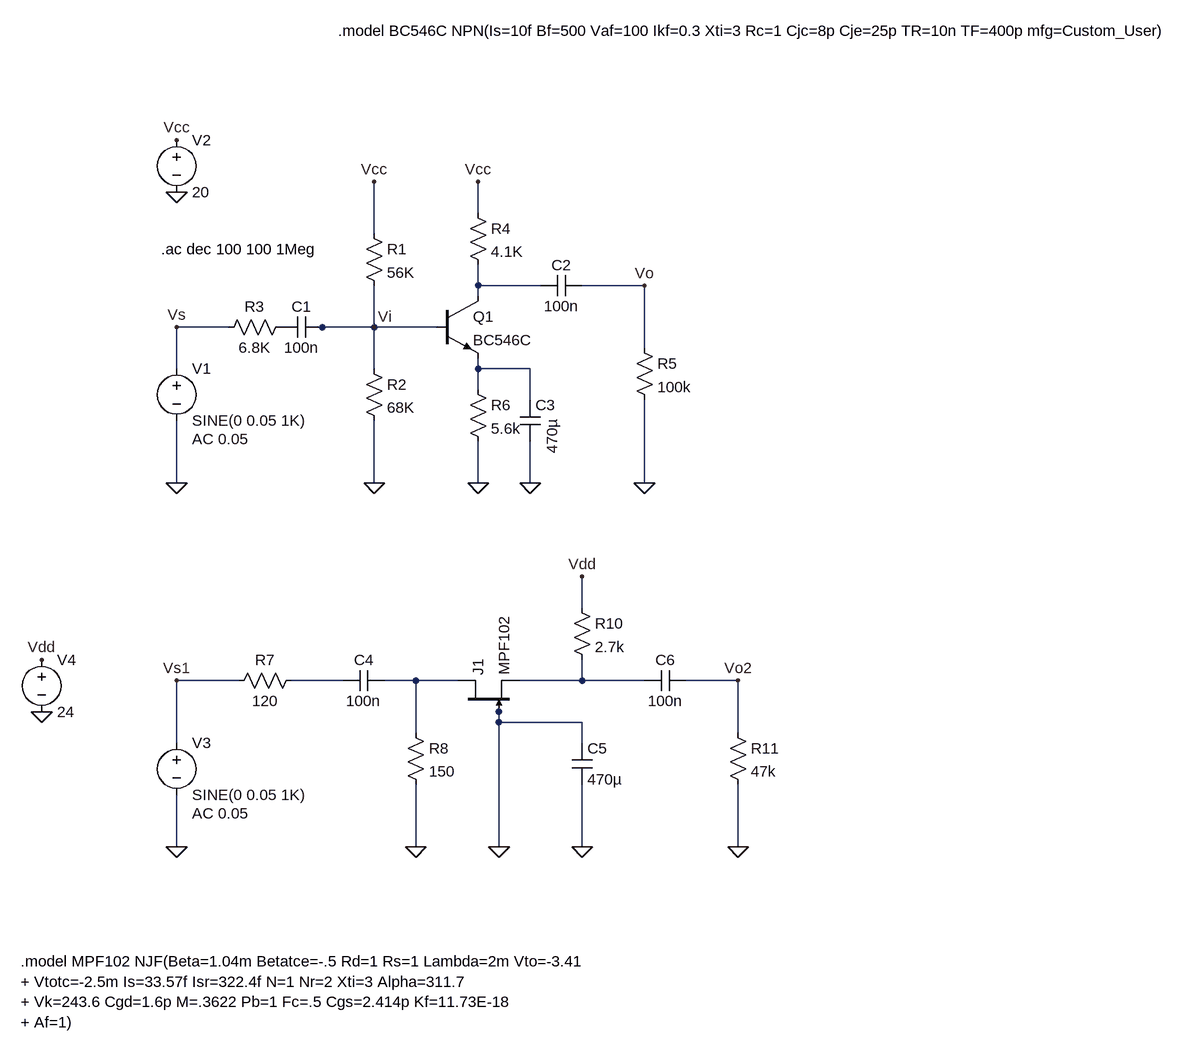
[diagram p0: schematic TP_EA1.asc]
TP_EA1.asc, the LTspice schematic file:
Version 4.1
SHEET 1 2792 1236
WIRE 224 -16 224 -64
WIRE 64 16 64 -64
WIRE 224 96 224 64
WIRE 320 96 224 96
WIRE 480 96 384 96
WIRE 224 112 224 96
WIRE -160 160 -240 160
WIRE -16 160 -32 160
WIRE 64 160 64 96
WIRE 64 160 -16 160
WIRE 160 160 64 160
WIRE 480 192 480 96
WIRE -240 224 -240 160
WIRE 64 224 64 160
WIRE 224 224 224 208
WIRE 304 224 224 224
WIRE 224 256 224 224
WIRE 304 272 304 224
WIRE -240 400 -240 304
WIRE 64 400 64 304
WIRE 224 400 224 336
WIRE 304 400 304 336
WIRE 480 400 480 272
WIRE 384 592 384 544
WIRE -144 704 -240 704
WIRE 16 704 -64 704
WIRE 128 704 80 704
WIRE 192 704 128 704
WIRE 384 704 384 672
WIRE 384 704 288 704
WIRE 480 704 384 704
WIRE 624 704 544 704
WIRE 256 752 256 736
WIRE 256 768 256 752
WIRE 384 768 256 768
WIRE 128 784 128 704
WIRE 624 784 624 704
WIRE -240 800 -240 704
WIRE 384 800 384 768
WIRE -240 960 -240 880
WIRE 128 960 128 864
WIRE 256 960 256 768
WIRE 384 960 384 864
WIRE 624 960 624 864
FLAG -240 400 0
FLAG 64 400 0
FLAG 64 -64 Vcc
FLAG 224 -64 Vcc
FLAG 480 400 0
FLAG 224 400 0
FLAG 304 400 0
FLAG -240 -48 0
FLAG -240 -128 Vcc
FLAG 64 160 Vi
FLAG 480 96 Vo
FLAG -240 160 Vs
FLAG -240 960 0
FLAG 624 960 0
FLAG 384 960 0
FLAG 256 960 0
FLAG 128 960 0
FLAG 384 544 Vdd
FLAG -448 752 0
FLAG -448 672 Vdd
FLAG 624 704 Vo2
FLAG -240 704 Vs1
SYMBOL res 48 0 R0
SYMATTR InstName R1
SYMATTR Value 56K
SYMBOL res 48 208 R0
SYMATTR InstName R2
SYMATTR Value 68K
SYMBOL cap -16 144 R90
WINDOW 0 0 32 VBottom 2
WINDOW 3 32 32 VTop 2
SYMATTR InstName C1
SYMATTR Value 100n
SYMBOL res -64 144 R90
WINDOW 0 0 56 VBottom 2
WINDOW 3 32 56 VTop 2
SYMATTR InstName R3
SYMATTR Value 6.8K
SYMBOL voltage -240 208 R0
WINDOW 123 24 124 Left 2
WINDOW 39 0 0 Left 0
SYMATTR Value2 AC 0.05
SYMATTR InstName V1
SYMATTR Value SINE(0 0.05 1K)
SYMBOL res 208 -32 R0
SYMATTR InstName R4
SYMATTR Value 4.1K
SYMBOL cap 384 80 R90
WINDOW 0 0 32 VBottom 2
WINDOW 3 32 32 VTop 2
SYMATTR InstName C2
SYMATTR Value 100n
SYMBOL res 464 176 R0
SYMATTR InstName R5
SYMATTR Value 100k
SYMBOL res 208 240 R0
SYMATTR InstName R6
SYMATTR Value 5.6k
SYMBOL cap 288 272 R0
WINDOW 3 50 83 VLeft 2
SYMATTR Value 470µ
SYMATTR InstName C3
SYMBOL voltage -240 -144 R0
WINDOW 123 0 0 Left 0
WINDOW 39 0 0 Left 0
SYMATTR InstName V2
SYMATTR Value 20
SYMBOL npn 160 112 R0
SYMATTR InstName Q1
SYMATTR Value BC546C
SYMBOL voltage -240 784 R0
WINDOW 123 24 124 Left 2
WINDOW 39 0 0 Left 0
SYMATTR Value2 AC 0.05
SYMATTR InstName V3
SYMATTR Value SINE(0 0.05 1K)
SYMBOL res -48 688 R90
WINDOW 0 0 56 VBottom 2
WINDOW 3 32 56 VTop 2
SYMATTR InstName R7
SYMATTR Value 120
SYMBOL cap 80 688 R90
WINDOW 0 0 32 VBottom 2
WINDOW 3 32 32 VTop 2
SYMATTR InstName C4
SYMATTR Value 100n
SYMBOL res 112 768 R0
SYMATTR InstName R8
SYMATTR Value 150
SYMBOL cap 368 800 R0
SYMATTR InstName C5
SYMATTR Value 470µ
SYMBOL res 368 576 R0
SYMATTR InstName R10
SYMATTR Value 2.7k
SYMBOL res 608 768 R0
SYMATTR InstName R11
SYMATTR Value 47k
SYMBOL cap 544 688 R90
WINDOW 0 0 32 VBottom 2
WINDOW 3 32 32 VTop 2
SYMATTR InstName C6
SYMATTR Value 100n
SYMBOL njf 192 752 R270
SYMATTR InstName J1
SYMATTR Value MPF102
SYMBOL voltage -448 656 R0
WINDOW 123 0 0 Left 0
WINDOW 39 0 0 Left 0
SYMATTR InstName V4
SYMATTR Value 24
TEXT 8 -296 Left 2 !.model BC546C NPN(Is=10f Bf=500 Vaf=100 Ikf=0.3 Xti=3 Rc=1 Cjc=8p Cje=25p TR=10n TF=400p mfg=Custom_User)
TEXT -264 40 Left 2 !.ac dec 100 100 1Meg
TEXT -480 1136 Left 2 !.model MPF102 NJF(Beta=1.04m Betatce=-.5 Rd=1 Rs=1 Lambda=2m Vto=-3.41\n+ Vtotc=-2.5m Is=33.57f Isr=322.4f N=1 Nr=2 Xti=3 Alpha=311.7\n+ Vk=243.6 Cgd=1.6p M=.3622 Pb=1 Fc=.5 Cgs=2.414p Kf=11.73E-18\n+ Af=1)

The netlist it stands for:
* TP_EA1.asc
R1 Vcc Vi 56K
R2 Vi 0 68K
C1 Vi P001 100n
R3 P001 Vs 6.8K
V1 Vs 0 SINE(0 0.05 1K) AC 0.05
R4 Vcc N001 4.1K
C2 Vo N001 100n
R5 Vo 0 100k
R6 N002 0 5.6k
C3 N002 0 470µ
V2 Vcc 0 20
Q1 N001 Vi N002 0 BC546C
V3 Vs1 0 SINE(0 0.05 1K) AC 0.05
R7 N003 Vs1 120
C4 N004 N003 100n
R8 N004 0 150
C5 0 0 470µ
R10 Vdd N005 2.7k
R11 Vo2 0 47k
C6 Vo2 N005 100n
J1 N004 0 N005 MPF102
V4 Vdd 0 24
.model NPN NPN
.model PNP PNP
.lib standard.bjt
.model NJF NJF
.model PJF PJF
.lib standard.jft
.model BC546C NPN(Is=10f Bf=500 Vaf=100 Ikf=0.3 Xti=3 Rc=1 Cjc=8p Cje=25p TR=10n TF=400p mfg=Custom_User)
.ac dec 100 100 1Meg
.model MPF102 NJF(Beta=1.04m Betatce=-.5 Rd=1 Rs=1 Lambda=2m Vto=-3.41
+ Vtotc=-2.5m Is=33.57f Isr=322.4f N=1 Nr=2 Xti=3 Alpha=311.7
+ Vk=243.6 Cgd=1.6p M=.3622 Pb=1 Fc=.5 Cgs=2.414p Kf=11.73E-18
+ Af=1)
.backanno
.end